# EAGLE design Modul Relay (EAGLE 7.6.0)
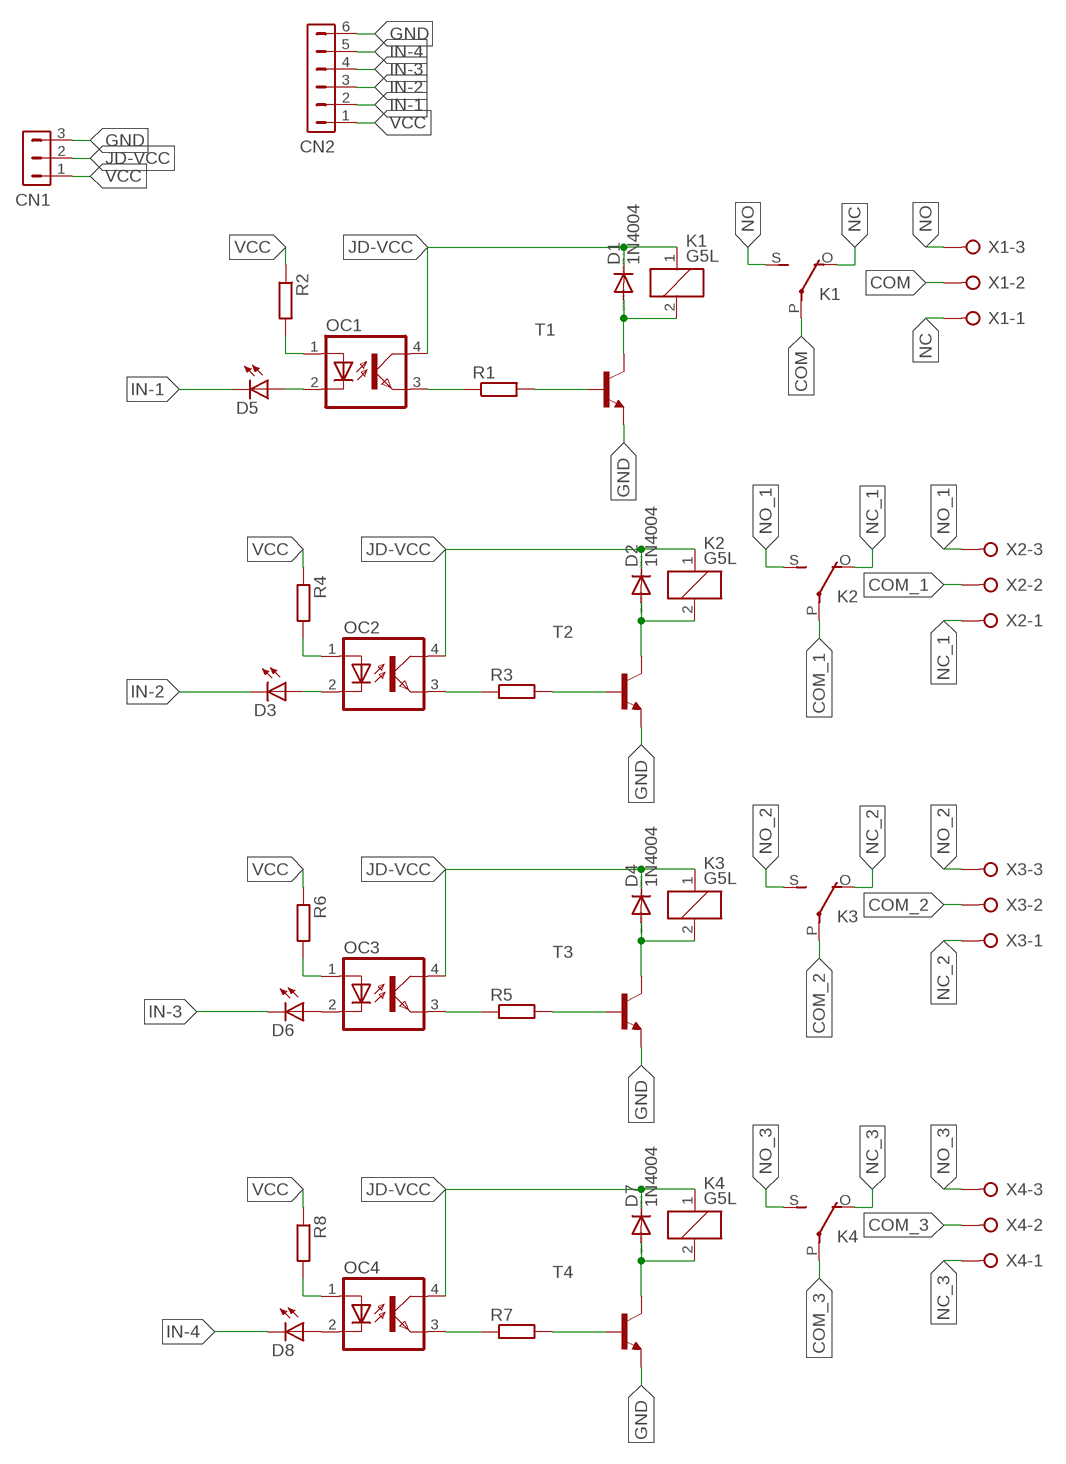
[diagram p0: schematic, sheet 1]

## Parts
CN1  HDR-1X3  [SIP-100-3V]
CN2  HDR-1X6-SIP-100  [SIP-100-6V]
D1  1N4004  [DO41-10]
D2  1N4004  [DO41-10]
D3  LED3MM  [LED3MM]
D4  1N4004  [DO41-10]
D5  LED3MM  [LED3MM]
D6  LED3MM  [LED3MM]
D7  1N4004  [DO41-10]
D8  LED3MM  [LED3MM]
K1  G5L  [G5LE]
K2  G5L  [G5LE]
K3  G5L  [G5LE]
K4  G5L  [G5LE]
OC1  PC817  [DIL04]
OC2  PC817  [DIL04]
OC3  PC817  [DIL04]
OC4  PC817  [DIL04]
R1  R-EU_R0805  [R0805]
R2  R-EU_R0805  [R0805]
R3  R-EU_R0805  [R0805]
R4  R-EU_R0805  [R0805]
R5  R-EU_R0805  [R0805]
R6  R-EU_R0805  [R0805]
R7  R-EU_R0805  [R0805]
R8  R-EU_R0805  [R0805]
T1  -NPN-TO92-ECB  [TO92-ECB]
T2  -NPN-TO92-ECB  [TO92-ECB]
T3  -NPN-TO92-ECB  [TO92-ECB]
T4  -NPN-TO92-ECB  [TO92-ECB]
X1  W237-3E  [W237-3E]
X2  W237-3E  [W237-3E]
X3  W237-3E  [W237-3E]
X4  W237-3E  [W237-3E]

## Nets
COM: K1.P(2:P) X1.2
COM_1: K2.P(2:P) X2.2
COM_2: K3.P(2:P) X3.2
COM_3: K4.P(2:P) X4.2
GND: CN1.3 CN2.6 T1.E T2.E T3.E T4.E
IN-1: CN2.2 D5.K(C)
IN-2: CN2.3 D3.K(C)
IN-3: CN2.4 D6.K(C)
IN-4: CN2.5 D8.K(C)
JD-VCC: CN1.2 D1.C D2.C D4.C D7.C K1.1 K2.1 K3.1 K4.1 OC1.4(COL) OC2.4(COL) OC3.4(COL) OC4.4(COL)
N$1: D2.A K2.2 T2.C
N$2: D1.A K1.2 T1.C
N$3: OC1.1(A) R2.2
N$4: R3.2 T2.B
N$5: OC2.3(EMIT) R3.1
N$6: D3.A OC2.2(C)
N$7: OC2.1(A) R4.2
N$8: D4.A K3.2 T3.C
N$9: R1.2 T1.B
N$10: OC1.3(EMIT) R1.1
N$11: D5.A OC1.2(C)
N$12: R5.2 T3.B
N$13: OC3.3(EMIT) R5.1
N$14: D6.A OC3.2(C)
N$15: OC3.1(A) R6.2
N$16: D7.A K4.2 T4.C
N$17: R7.2 T4.B
N$18: OC4.3(EMIT) R7.1
N$19: D8.A OC4.2(C)
N$20: OC4.1(A) R8.2
NC: K1.O(2:O) X1.1
NC_1: K2.O(2:O) X2.1
NC_2: K3.O(2:O) X3.1
NC_3: K4.O(2:O) X4.1
NO: K1.S(2:S) X1.3
NO_1: K2.S(2:S) X2.3
NO_2: K3.S(2:S) X3.3
NO_3: K4.S(2:S) X4.3
VCC: CN1.1 CN2.1 R2.1 R4.1 R6.1 R8.1

## Library data of the parts
CN1 = con-hdrs40:HDR-1X3: HEADER CONNECTOR
CN2 = con-hdrs40:HDR-1X6: HEADER CONNECTOR
D1 D2 D4 D7 = diode:1N4004: DIODE general purpose rectifier, 1 A
D3 D5 D6 D8 = led:LED: LED OSRAM: - CHIPLED LG R971, LG N971, LY N971, LG Q971, LY Q971, LO R971, LY R971 LH N974, LH R974 LS Q976, LO Q976, LY Q976 LO Q996 - Hyper CHIPLED LW Q18S LB Q993, LB Q99A, LB R99A - SideLED LS A670, LO A670, LY A670, LG A670, LP A670 LB A673, LV A673, LT A673, LW A673 LH A674 LY A675 LS A676, LA A676, LO A676, LY A676, LW A676 LS A679, LY A679, LG A679 - Hyper Micro SIDELED® LS Y876, LA Y876, LO Y876, LY Y876 LT Y87S - SmartLED LW L88C, LW L88S LB L89C, LB L89S, LG L890 LS L89K, LO L89K, LY L89K LS L896, LA L896, LO L896, LY L896 - TOPLED LS T670, LO T670, LY T670, LG T670, LP T670 LSG T670, LSP T670, LSY T670, LOP T670, LYG T670 LG T671, LOG T671, LSG T671 LB T673, LV T673, LT T673, LW T673 LH T674 LS T676, LA T676, LO T676, LY T676, LB T676, LH T676, LSB T676, LW T676 LB T67C, LV T67C, LT T67C, LS T67K, LO T67K, LY T67K, LW E67C LS E67B, LA E67B, LO E67B, LY E67B, LB E67C, LV E67C, LT E67C LW T67C LS T679, LY T679, LG T679 LS T770, LO T770, LY T770, LG T770, LP T770 LB T773, LV T773, LT T773, LW T773 LH T774 LS E675, LA E675, LY E675, LS T675 LS T776, LA T776, LO T776, LY T776, LB T776 LHGB T686 LT T68C, LB T68C - Hyper Mini TOPLED® LB M676 - Mini TOPLED Santana® LG M470 LS M47K, LO M47K, LY M47K Source: http://www.osram.convergy.de LUXEON: - LUMILED® LXK2-PW12-R00, LXK2-PW12-S00, LXK2-PW14-U00, LXK2-PW14-V00 LXK2-PM12-R00, LXK2-PM12-S00, LXK2-PM14-U00 LXK2-PE12-Q00, LXK2-PE12-R00, LXK2-PE12-S00, LXK2-PE14-T00, LXK2-PE14-U00 LXK2-PB12-K00, LXK2-PB12-L00, LXK2-PB12-M00, LXK2-PB14-N00, LXK2-PB14-P00, LXK2-PB14-Q00 LXK2-PR12-L00, LXK2-PR12-M00, LXK2-PR14-Q00, LXK2-PR14-R00 LXK2-PD12-Q00, LXK2-PD12-R00, LXK2-PD12-S00 LXK2-PH12-R00, LXK2-PH12-S00 LXK2-PL12-P00, LXK2-PL12-Q00, LXK2-PL12-R00 Source: www.luxeon.com KINGBRIGHT: KA-3528ASYC Source: www.kingbright.com
K1-K4 = relay:G5L: RELAY 1 x switch, 10 A/120 V AC, 8 A/30 V ADC, Omron; OC_FARNELL: unknown; OC_NEWARK: unknown
OC1-OC4 = optocoupler:PC817: SHARP OPTO COUPLER
R1-R8 = rcl:R-EU_: RESISTOR, European symbol
T1-T4 = transistor:*-NPN-: NPN Transistror BF959 corrected 2008.03.06
X1-X4 = con-wago-508:W237-3E: WAGO SREW CLAMP; OC_FARNELL: unknown; OC_NEWARK: unknown

## Board
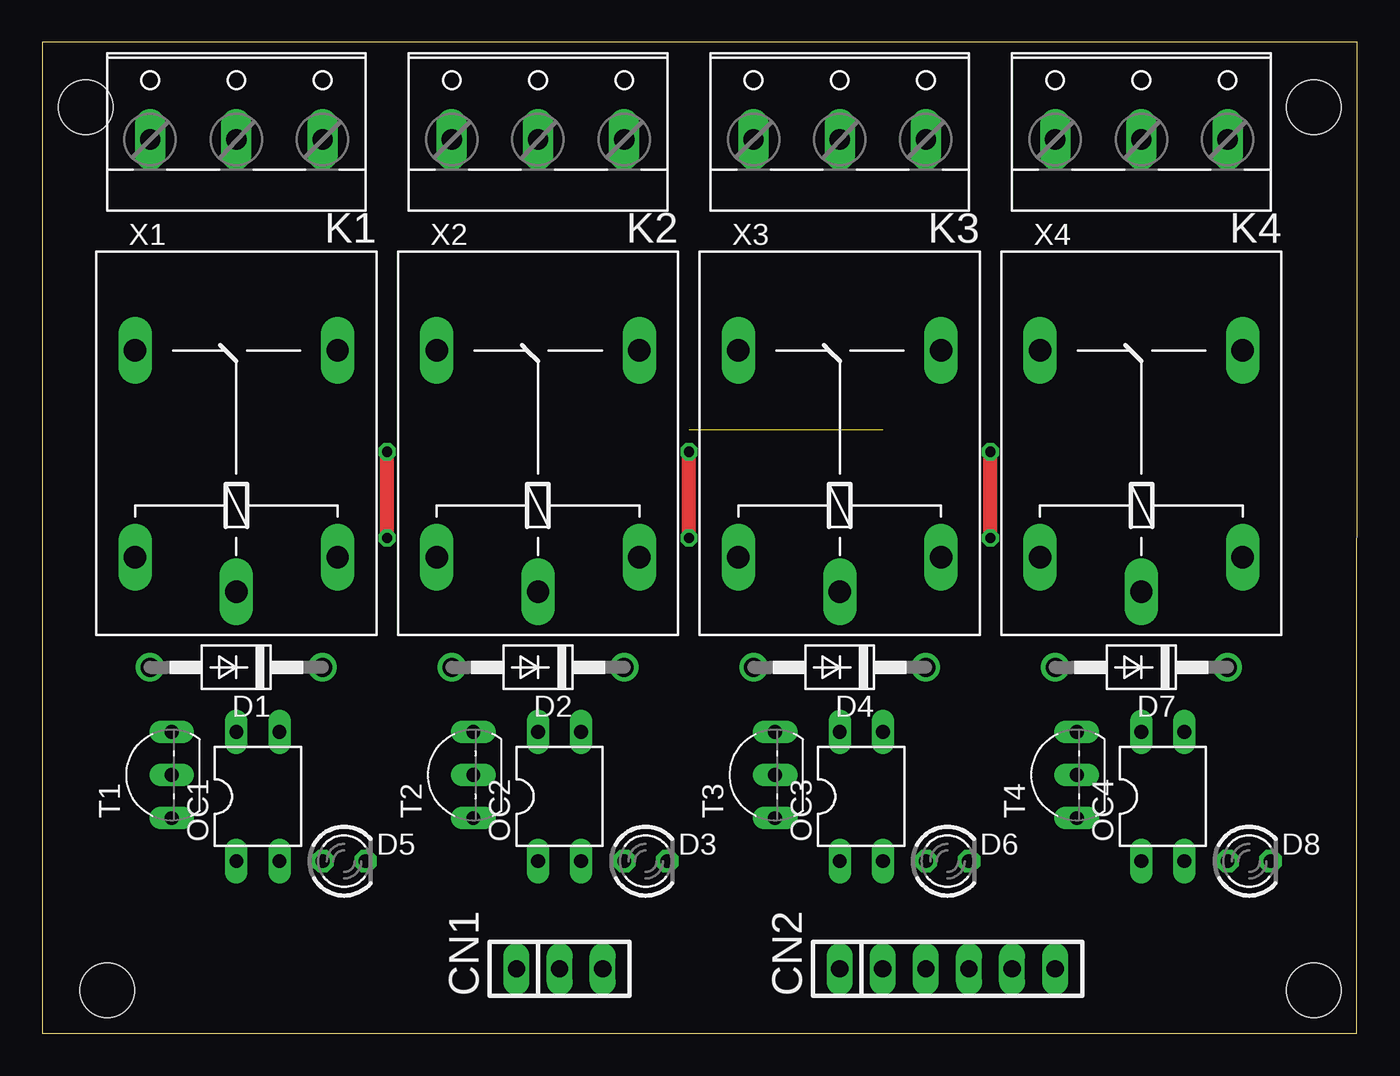
[diagram p1: board, top side]
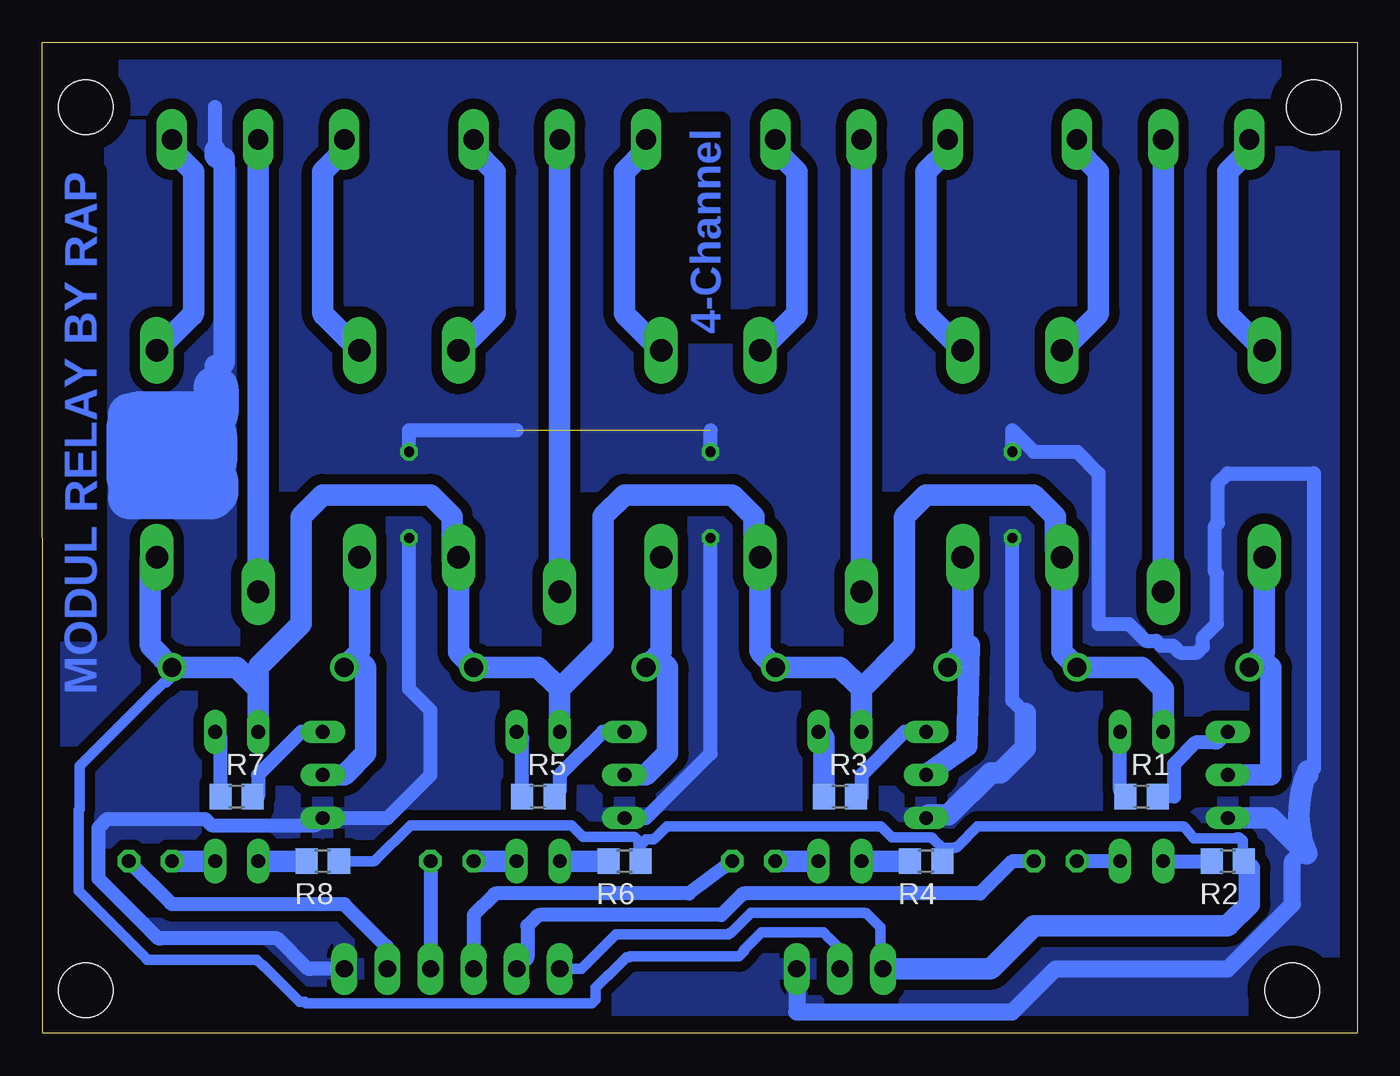
[diagram p2: board, bottom side, seen from below]

Size 77.48 x 58.42 mm. Coordinates in mm from the lower left corner, seen from the top.
Outline: 0,0 77.45,0 77.48,58.42 0,58.42 0,0
Copper layers (1*16): Top 0.035mm / dielectric 1.5mm / Bottom 0.035mm
Design rules "default": minimum track width 10mil, minimum drill 24mil, track to track 8mil, track to pad 8mil, pad to pad 8mil, via to via 8mil, smd to smd 8mil, copper to edge 40mil, drill to drill 8mil, minimum pad ring 10mil, minimum via ring 8mil, stop-mask expansion 4mil, vias tented up to drill 0mil, thermal gap 10mil
Holes 3.2 mm at 3.81,2.54 74.93,2.54 2.54,54.61 74.93,54.61

### Footprints (pad centres in the part's own frame; a part is rotated, then mirrored left to right if it is on the bottom)
SIP-100-3V = drill 1.016 long: 1 -2.54,0; 2 0,0; 3 2.54,0
SIP-100-6V = drill 1.016 long: 1 -6.35,0; 2 -3.81,0; 3 -1.27,0; 4 1.27,0; 5 3.81,0; 6 6.35,0
DO41-10 = drill 1.118: A 5.08,0; C -5.08,0
LED3MM = drill 0.813 octagon: A -1.27,0; K 1.27,0
G5LE = drill 1.321 long: 1 -7.493,-5.969; 2 -7.493,5.969; O 4.699,5.969; P -9.525,0; S 4.699,-5.969
DIL04 = drill 0.813 long: 1 -1.27,-3.81; 2 1.27,-3.81; 3 1.27,3.81; 4 -1.27,3.81
R0805 = smd 1.3 x 1.5: 1 -0.95,0; 2 0.95,0
TO92-ECB = drill 0.813 long: B 2.54,0; C 0,0; E -2.54,0
W237-3E = drill 1.194 long: 1 -5.08,-0.635; 2 0,-0.635; 3 5.08,-0.635

### Placement (x,y rotation side)
CN1  30.48,3.81 0 top
CN2  53.34,3.81 0 top
D1  11.43,21.59 180 top
D2  29.21,21.59 180 top
D3  35.56,10.16 0 top
D4  46.99,21.59 180 top
D5  17.78,10.16 0 top
D6  53.34,10.16 0 top
D7  64.77,21.59 180 top
D8  71.12,10.16 0 top
K1  11.43,35.56 90 top
K2  29.21,35.56 90 top
K3  46.99,35.56 90 top
K4  64.77,35.56 90 top
OC1  12.7,13.97 0 top
OC2  30.48,13.97 0 top
OC3  48.26,13.97 0 top
OC4  66.04,13.97 0 top
R1  12.7,13.97 0 bottom
R2  7.62,10.16 180 bottom
R3  30.48,13.97 0 bottom
R4  25.4,10.16 180 bottom
R5  48.26,13.97 0 bottom
R6  43.18,10.16 180 bottom
R7  66.04,13.97 0 bottom
R8  60.96,10.16 180 bottom
T1  7.62,15.24 90 top
T2  25.4,15.24 90 top
T3  43.18,15.24 90 top
T4  60.96,15.24 90 top
X1  11.43,53.34 0 top
X2  29.21,53.34 0 top
X3  46.99,53.34 0 top
X4  64.77,53.34 0 top

### Tracks (layer width: path | path; a pad name or v marks a point on that pad's centre or on a via)
COM
  Bottom 1.27: K1.P X1.2 11.43,53.34
COM_1
  Bottom 1.27: K2.P X2.2
COM_2
  Bottom 1.27: K3.P X3.2
COM_3
  Bottom 1.27: K4.P X4.2 64.77,53.34
GND  (via drill 0.6)  (1 unrouted)
  Top 0.813: v20.32,29.21 v20.32,34.29 | v38.1,29.21 v38.1,34.29 | v55.88,29.21 v55.88,34.29
  Bottom 0.813: CN2.6 61.72,3.81 arc45 61.9,3.88 63.63,5.61 70.55,5.61 arc45 70.73,5.68 73.62,8.57 arc-45 73.62,8.57 74.17,9.12 74.17,12.04 arc45 74.1,12.22 73.68,12.64 67.99,12.64 arc45 67.81,12.57 67.51,12.27 61.49,12.27 arc-45 61.31,12.35 T4.E 57.15,12.7 54.61,15.24 54.61,19.05 55.88,20.32 v55.88,29.21 | 19.55,18.86 20.32,19.63 v20.32,29.21 | v20.32,34.29 20.32,35.56 19.05,34.29 16.51,34.29 15.24,33.02 15.24,24.13 13.44,24.13 12.46,23.15 11.85,23.15 11.57,22.87 10.84,22.87 10.4,22.44 9.45,22.44 9.09,22.81 9.09,23.33 8.26,24.16 8.26,27.11 8.38,27.23 8.38,29.9 8.2,30.09 8.2,32.45 7.62,33.02 2.54,33.02 2.54,15.6 2.9,15.24 | T3.E 41.91,12.7 38.1,16.51 v38.1,29.21 | v38.1,34.29 38.1,35.56 | v55.88,34.29 55.88,35.56 49.53,35.56 | 67.31,52.07 67.31,54.61 | 67.31,38.1 67.31,39.37
  Bottom 1.016: CN1.3 33.02,1.27 20.32,1.27 17.78,3.81 7.62,3.81 3.81,7.62 3.81,10.16 3.17,10.79
  Bottom 1.27: T1.E 5.08,12.7 3.17,10.79 2.97,10.59 arc45 2.9,15.49 2.9,15.24 | T2.E 25.23,12.87 24.08,12.87 21.59,15.36 21.02,15.36 19.55,16.82 19.55,18.86 | 67.31,39.37 67.03,39.37 arc-90 66.77,39.62 66.77,51.59 67.06,51.59 arc90 67.31,51.84 67.31,52.07
  Bottom 2.54: 67.31,38.1 arc90 67.19,37.98 67.19,36.56 71.9,36.56 arc-90 72.08,36.39 72.08,35.23 67.46,35.23 arc-90 67.37,35.32 arc90 67.28,35.23 67.28,33.72 72.09,33.72 arc-90 72.35,33.46 72.35,31.58 67.55,31.58 arc-90 67.37,31.76 arc-90 67.19,31.94 67.19,32.56 72.18,32.56 arc90 72.44,32.81 72.44,35.76 arc-90 72.35,35.85 72.35,36.48
  pour Bottom (isolate 0.61, rank 2): 0,0 77.47,0 77.47,58.42 0,58.42
IN-1
  Bottom 0.813: D5.K 20.21,10.16 arc-45 20.39,10.09 22.23,8.26 36.09,8.26 arc-45 36.27,8.18 37.47,6.99 48.16,6.99 arc-45 48.33,6.91 48.9,6.35 48.9,4.55 arc45 48.97,4.37 CN2.2
IN-2
  Bottom 0.813: D3.K 39.37,8.26 50.7,8.26 arc-45 50.87,8.18 52.07,6.99 CN2.3
IN-3
  Bottom 0.813: D6.K CN2.4
IN-4
  Bottom 0.813: CN2.5 57.15,4.97 arc-45 57.22,5.15 59.69,7.62 69.75,7.62 arc45 69.92,7.69 D8.K
JD-VCC
  Bottom 0.61: CN1.2 30.48,5.01 31.09,5.62 31.12,5.62 31.46,5.96 35.11,5.96 36.13,4.94 36.13,4.85 36.43,4.54 42.85,4.54 42.91,4.48 43.06,4.48 44.11,3.44 44.14,3.44 44.87,2.7 44.87,2 45.09,1.78 61.94,1.78 62.03,1.87 62.34,1.87 64.46,3.99 64.49,3.99 64.86,4.36 71.3,4.36 71.55,4.61 75.35,8.41 75.35,13.17 75.29,13.23 75.29,15.78 74.03,17.04 70.78,20.29 70.75,20.29 70.35,20.69 70.2,20.69 69.86,21.03 D7.C
  Bottom 1.27: K4.1 70.89,28.07 arc-45 71.07,27.99 71.12,27.94 71.12,22.96 arc-45 71.05,22.79 D7.C 66.04,21.59 64.84,20.39 arc45 64.77,20.21 | OC1.4 11.43,20.32 12.63,21.52 arc-45 12.8,21.59 D1.C 17.32,22.41 arc45 17.4,22.58 K1.1 17.71,28.37 arc45 17.78,28.55 17.78,30.48 18.98,31.68 arc-45 19.16,31.75 25.4,31.75 26.6,30.55 arc-45 26.67,30.38 26.67,22.86 29.14,20.39 arc-45 29.21,20.21 | 29.21,20.21 arc-45 29.28,20.39 30.48,21.59 D2.C 35.1,22.41 arc45 35.18,22.58 K2.1 35.23,28.01 arc45 35.41,27.94 35.56,27.94 35.56,30.48 36.76,31.68 arc-45 36.94,31.75 43.18,31.75 44.38,30.55 arc-45 44.45,30.38 44.45,22.86 46.92,20.39 arc-45 46.99,20.21 | OC2.4 29.21,20.21 | OC3.4 46.99,20.21 | 46.99,20.21 arc-45 47.06,20.39 48.26,21.59 D4.C 52.88,22.41 arc45 52.96,22.58 K3.1 53.11,28.07 arc-45 53.29,27.99 53.34,27.94 53.34,30.48 54.61,31.75 60.96,31.75 62.16,30.55 arc-45 62.23,30.38 62.23,24.13 64.7,21.66 arc-45 64.77,21.48 64.77,20.21 | OC4.4 64.77,20.21
N$1
  Bottom 0.813: 22.86,22.86 D2.A
  Bottom 1.27: D2.A 23.32,22.41 arc-45 23.24,22.58 K2.2 | T2.C 22.98,16.95 22.86,22.86
N$2
  Bottom 1.27: D1.A 5.71,22.23 | 5.71,22.23 5.54,22.41 arc-45 5.46,22.58 K1.2 | T1.C 5.08,15.24 5.08,21.59 5.71,22.23
N$3
  Bottom 0.813: OC1.1 R2.2
N$4
  Bottom 0.813: T2.B 26.67,17.78 29.14,15.31 arc-45 29.21,15.13 29.21,13.97 R3.2
N$5
  Bottom 1.27: R3.1 31.43,17.36 arc-45 31.5,17.53 OC2.3
N$6
  Bottom 1.27: OC2.2 D3.A
N$7
  Bottom 1.27: OC2.1 R4.2
N$8
  Bottom 1.27: D4.A 41.27,22.23 | 41.27,22.23 41.09,22.41 arc-45 41.02,22.58 K3.2 | T3.C 42.02,15.24 arc-45 41.84,15.31 40.64,16.51 40.64,21.48 arc-45 40.71,21.66 41.27,22.23
N$9
  Bottom 0.813: T1.B 8.18,17.22 arc45 8.36,17.14 9.53,17.14 10.72,15.95 arc-45 10.79,15.77 10.79,13.97 R1.2
N$10
  Bottom 0.813: R1.1 13.9,14.22 arc45 13.97,14.39 OC1.3
N$11
  Bottom 0.813: OC1.2 D5.A
N$12
  Bottom 0.813: T3.B 44.45,17.78 46.99,15.24 46.99,14.39 arc45 47.06,14.22 R5.2
N$13
  Bottom 0.813: R5.1 49.21,17.36 arc-45 49.28,17.53 OC3.3
N$14
  Bottom 1.27: OC3.2 D6.A
N$15
  Bottom 1.27: OC3.1 R6.2
N$16
  Bottom 1.27: D7.A 59.05,22.23 | 59.05,22.23 58.88,22.41 arc-45 58.8,22.58 K4.2 | T4.C 59.8,15.24 arc-45 59.62,15.31 58.42,16.51 58.42,21.48 arc-45 58.49,21.66 59.05,22.23
N$17
  Bottom 0.813: T4.B 62.23,17.78 64.77,15.24 64.77,13.97 R7.2
N$18
  Bottom 0.813: R7.1 66.99,17.36 arc-45 67.06,17.53 OC4.3
N$19
  Bottom 1.27: OC4.2 D8.A
N$20
  Bottom 1.27: R8.2 OC4.1
NC
  Bottom 1.27: K1.O 7.55,42.34 arc45 7.62,42.52 7.62,50.8 6.42,52 arc-45 6.35,52.17 X1.1
NC_1
  Bottom 1.27: K2.O 25.33,42.34 arc45 25.4,42.52 25.4,50.8 24.13,52.07 X2.1
NC_2
  Bottom 1.27: K3.O 43.11,42.34 arc45 43.18,42.52 43.18,50.8 41.98,52 arc-45 41.91,52.17 X3.1
NC_3
  Bottom 1.27: K4.O 60.89,42.34 arc45 60.96,42.52 60.96,50.8 59.76,52 arc-45 59.69,52.17 X4.1
NO
  Bottom 1.27: K1.S 15.31,42.34 arc-45 15.24,42.52 15.24,50.8 16.44,52 arc45 16.51,52.17 X1.3
NO_1
  Bottom 1.27: K2.S 33.09,42.34 arc-45 33.02,42.52 33.02,50.8 34.22,52 arc45 34.29,52.17 X2.3
NO_2
  Bottom 1.27: K3.S 50.87,42.34 arc-45 50.8,42.52 50.8,50.8 52,52 arc45 52.07,52.17 X3.3
NO_3
  Bottom 1.27: K4.S 68.65,42.34 arc-45 68.58,42.52 68.58,50.8 69.78,52 arc45 69.85,52.17 X4.3
VCC
  Bottom 0.61: R8.1 58.02,10.16 arc-45 57.84,10.23 55.8,12.28 46.41,12.28 arc45 46.23,12.2 45.62,11.6 42.7,11.6 arc45 42.52,11.52 42.34,11.35 42.34,10.38 arc-45 42.27,10.2 R6.1 42.23,11.01 arc45 42.16,11.18 41.91,11.43 41.57,11.43 arc-45 41.39,11.5 40.67,12.22 28.19,12.22 arc45 28.01,12.15 27.41,11.55 25.18,11.55 arc45 25,11.48 24.42,10.91 24.42,10.22 arc45 R4.1 24.45,10.91 arc-45 24.47,10.96 23.72,10.96 arc-45 23.54,11.03 22.37,12.2 10.31,12.2 arc45 10.13,12.13 9.63,11.51 7.12,11.51 arc45 6.96,11.57 6.74,11.34 6.74,10.33 arc-45 R2.1 | CN2.1 45.72,3.81 44.45,5.08 44.45,5.09 43.68,5.86 37.03,5.86 36.95,5.95 36.91,5.95 35.73,7.12 29.03,7.12 28.99,7.07 28.92,7.07 28.11,6.26 28.11,3.98 CN1.1
  Bottom 0.813: R2.1 6.42,9.91 arc45 6.35,9.73
  Bottom 1.27: CN1.1 21.7,3.81 arc-45 21.52,3.88 19.05,6.35 7.72,6.35 arc-45 7.55,6.42 6.35,7.62 6.35,9.73

### Text on the board
Bottom: MODUL RELAY BY RAP | 4-Channel